# Altium schematic sheet power.SchDoc
size A4; SheetNumber: 3; SheetTotal: 4
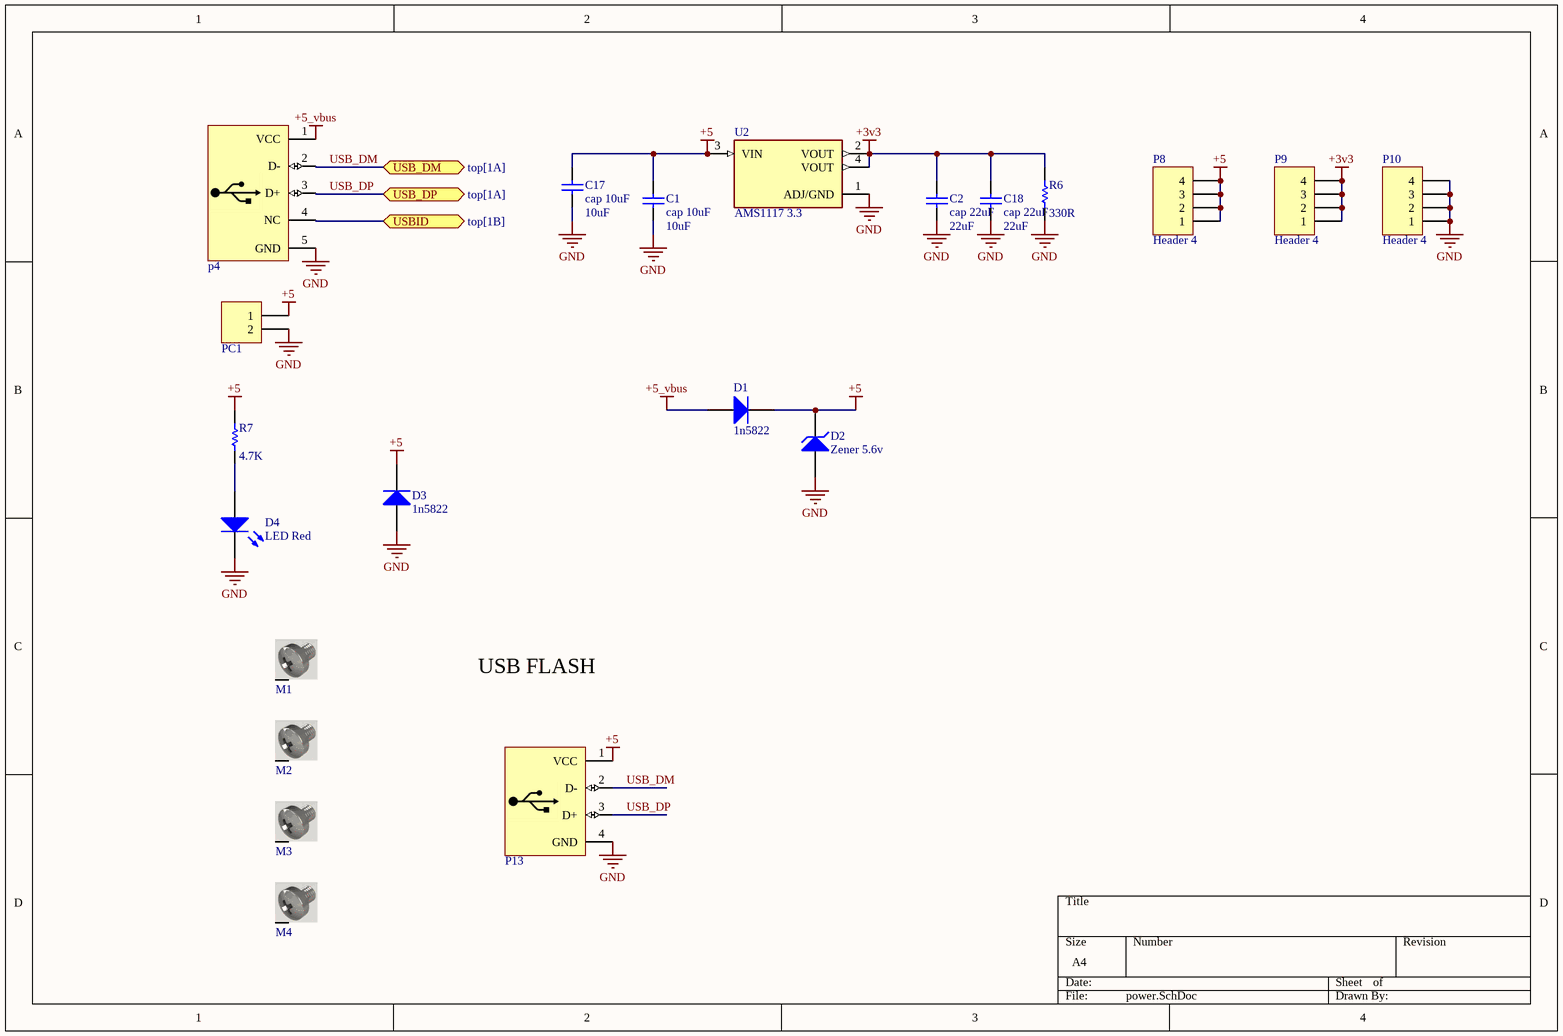
[diagram p0: power.SchDoc]

## Parts
C1  cap 10uF  value 10uF  [Cap 805]
C2  cap 22uF  value 22uF  [Cap 805]
C17  cap 10uF  value 10uF  [Cap 805]
C18  cap 22uF  value 22uF  [Cap 805]
D1  1n5822  [SMA DIODE 2]
D2  Zener 5.6v  [Diode 1n4148 SMD]
D3  1n5822  [SMA DIODE 2]
D4  LED Red  [0805-LED]
M1  Spacer-ff 10mm  [Screw]  (value not drawn)
M2  Spacer-ff 10mm  [screw]  (value not drawn)
M3  Spacer-ff 10mm  [screw]  (value not drawn)
M4  Spacer-ff 10mm  [screw]  (value not drawn)
p4  USB Connector  [USB_AB_BM_SHS]  (value not drawn)
P8  Header 4  [HDR1X4]
P9  Header 4  [HDR1X4]
P10  Header 4  [HDR1X4]
P13  USB Connector A Type Femal  [USB2.5-2H4C]  (value not drawn)
PC1  Power Connector  [My_ Power_Connector]  (value not drawn)
R6  value 330R  [RES 0805 (2012X06L)]  (hidden comment: Res 330R)
R7  value 4.7K  [RES 0805 (2012X06L)]  (hidden comment: Res 4.7K)
U2  AMS1117 3.3  [SOT223]

## Ports
USB_DM (bidir, see top[1A]), USB_DP (bidir, see top[1A]), USBID (bidir, see top[1B])

## Nets
+3v3: C2.2 C18.2 P9.1 P9.2 P9.3 P9.4 R6.2 U2.2(VOUT) U2.4(VOUT)
+5: C1.2 C17.2 D1.2(K) D2.2(K) D3.2(K) P8.1 P8.2 P8.3 P8.4 P13.1(VCC) PC1.1 R7.2 U2.3(VIN)
+5_vbus: D1.1(A) p4.1(VCC)
GND: C1.1 C2.1 C17.1 C18.1 D2.1(A) D3.1(A) D4.2(K) p4.5(GND) P10.1 P10.2 P10.3 P10.4 P13.4(GND) PC1.2 R6.1 U2.1(ADJ/GND)
USB_DM: p4.2(D-) P13.2(D-) ; port USB_DM
USB_DP: p4.3(D+) P13.3(D+) ; port USB_DP
USBID: p4.4(NC) ; port USBID
NetD4_1: D4.1(A) R7.1

Not connected (* = marked no-connect by the designer): M1 S; M2 S; M3 S; M4 S

## Notes on the sheet
- USB FLASH

## Library data of the parts
C1 C2 C17 C18 = Cap: Capacitor; Published: 8-Jun-2000; LatestRevisionDate: 17-Jul-2002; LatestRevisionNote: Re-released for DXP Platform.; PackageReference: RAD-0.3; Publisher: Altium Limited; PackageDescription: Radial Cap, Thru-Hole; 2 Leads; 0.3 in Pin Spacing
D1 D3 = Diode 1N4007: 1 Amp schottky Diode; Published: 8-Jun-2000; LatestRevisionDate: 17-Jul-2002; LatestRevisionNote: Re-released for DXP Platform.; DatasheetVersion: 1998; PackageVersion: Aug-1999; PackageReference: DO-41; Publisher: Altium Limited; PackageDescription: Diode, Axial; Body 5.2 x 2.7 mm (LxDia. max), Lead Dia. 0.86 mm (max); Code_JEDEC: DO-204-AL; ComponentLink1Description: Manufacturer Link; ComponentLink1URL: http://www.fairchildsemi.com/; ComponentLink2Description: Datasheet; ComponentLink2URL: http://www.fairchildsemi.com/ds/1N%2F1N4001.pdf
D2 = D Zener: Zener Diode; Published: 8-Jun-2000; LatestRevisionDate: 17-Jul-2002; LatestRevisionNote: Re-released for DXP Platform.; PackageReference: DIODE-0.7; Publisher: Altium Limited; PackageDescription: Diode, Thru-Hole; 2 Leads; 0.7 in Pin Spacing
D4 = LED0: LED SMD; pin to pad: 1>A 2>C; Published: 8-Jun-2000; LatestRevisionDate: 08-Jul-2005; LatestRevisionNote: Mech Layer 1 removed.; PackageReference: LED-0; Publisher: Altium Limited; PackageDescription: LED; 2 Leads
M1-M4 = Board Screw: Board Screw With Spacer
p4 = USB MICRO: USB Connector MICRO-B Type; Designer: ABBAS BASEREH; Max Current: 1600mA; Mounting Technology: Surface Mount\Through-Hole; Category: Connector; Pin Count: 5-7; Publisher: ABBAS BASEREH; Status: Unreleased; ComponentLink1Description: Datasheet; ComponentLink2Description: Reference; Update: 1395-11-17
P8-P10 = Header 4: Header, 4-Pin; LatestRevisionDate: 17-Jul-2002; LatestRevisionNote: Re-released for DXP Platform.; Publisher: Altium Limited
P13 = USB A-Type: USB Connector-A Type Femal
PC1 = Power Connector: white Power Connector
R6 R7 = Res1: Resistor; Published: 8-Jun-2000; LatestRevisionDate: 17-Jul-2002; LatestRevisionNote: Re-released for DXP Platform.; PackageReference: AXIAL-0.3; Publisher: Altium Limited; PackageDescription: Axial Device, Thru-Hole; 2 Leads; 0.3 in Pin Spacing
U2 = AMS1117: MF: Seeed Technology; Availability: Unavailable; SnapEDA_Link: https://www.snapeda.com/parts/AMS1117/Seeed%20Technology%20Co.%2C%20Ltd/view-part/184428/?ref=snap; MP: AMS1117; Price: None; Value: *; Package: SOT-223 Seeed Technology